# EAGLE schematic fin_solder (EAGLE 7.5.0)
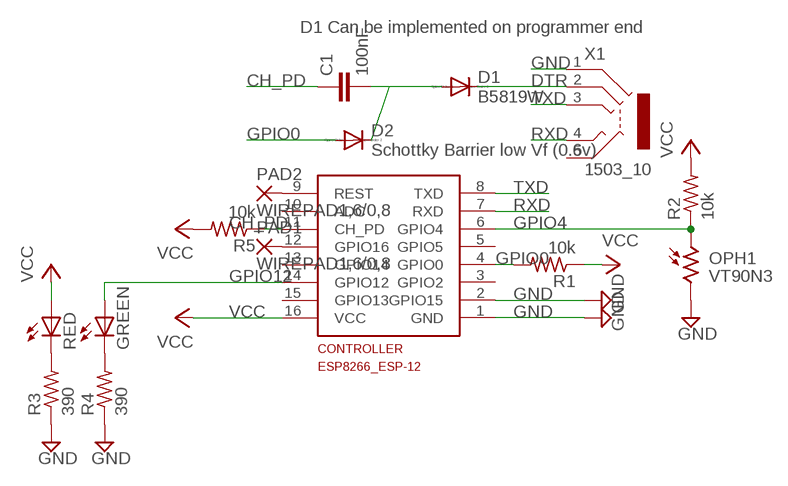
[diagram p0: schematic, sheet 1]

## Parts
C1  100nF  C-EUC0603  [C0603]
CONTROLLER  ESP8266_ESP-12  [ESP8266-ESP12]
D1  B5819W  DIODE-D-7.5  [D-7.5]
D2  Schottky Barrier low Vf (0.6v)  DIODE-D-7.5  [D-7.5]
GREEN  LED3MM  [LED3MM]
OPH1  VT90N3  [VT900]
PAD1  WIREPAD1,6/0,8  [1,6/0,8]
PAD2  WIREPAD1,6/0,8  [1,6/0,8]
R1  10k  R-US_0309/12  [0309/12]
R2  10k  R-US_0309/12  [0309/12]
R3  390  R-US_0309/12  [0309/12]
R4  390  R-US_0309/12  [0309/12]
R5  10k  R-US_0309/12  [0309/12]
RED  LED3MM  [LED3MM]
X1  1503_10  [1503_10]

## Nets
CH_PD: C1.1 CONTROLLER.11(CH_PD) R5.1
DTR: D1.C X1.2
GND: CONTROLLER.1(GND) CONTROLLER.2(GPIO15) OPH1.2 R3.1 R4.1 X1.1
GPIO0: CONTROLLER.4(GPIO0) D2.A R1.2
GPIO4: CONTROLLER.6(GPIO4) OPH1.1 R2.1
GPIO12: CONTROLLER.14(GPIO12) GREEN.A
N$1: C1.2 D1.A D2.C
N$2: R3.2 RED.K(C)
N$3: GREEN.K(C) R4.2
N$4: CONTROLLER.12(GPIO16) PAD1.1(P)
N$5: CONTROLLER.9(REST) PAD2.1(P)
RXD: CONTROLLER.7(RXD) X1.4
TXD: CONTROLLER.8(TXD) X1.3
VCC: CONTROLLER.16(VCC) R1.1 R2.2 R5.2 RED.A
Unconnected: CONTROLLER.3(GPIO2) CONTROLLER.5(GPIO5) CONTROLLER.10(ADC) CONTROLLER.13(GPIO14) CONTROLLER.15(GPIO13) X1.5

## Notes on the sheet
- D1 Can be implemented on programmer end

## Library data of the parts
C1 = rcl:C-EU: CAPACITOR, European symbol
CONTROLLER = ESP8266-ESP12:ESP8266_ESP-12
D1 D2 = diode:DIODE-: DIODE
GREEN RED = led:LED: LED OSRAM: - CHIPLED LG R971, LG N971, LY N971, LG Q971, LY Q971, LO R971, LY R971 LH N974, LH R974 LS Q976, LO Q976, LY Q976 LO Q996 - Hyper CHIPLED LW Q18S LB Q993, LB Q99A, LB R99A - SideLED LS A670, LO A670, LY A670, LG A670, LP A670 LB A673, LV A673, LT A673, LW A673 LH A674 LY A675 LS A676, LA A676, LO A676, LY A676, LW A676 LS A679, LY A679, LG A679 - Hyper Micro SIDELED® LS Y876, LA Y876, LO Y876, LY Y876 LT Y87S - SmartLED LW L88C, LW L88S LB L89C, LB L89S, LG L890 LS L89K, LO L89K, LY L89K LS L896, LA L896, LO L896, LY L896 - TOPLED LS T670, LO T670, LY T670, LG T670, LP T670 LSG T670, LSP T670, LSY T670, LOP T670, LYG T670 LG T671, LOG T671, LSG T671 LB T673, LV T673, LT T673, LW T673 LH T674 LS T676, LA T676, LO T676, LY T676, LB T676, LH T676, LSB T676, LW T676 LB T67C, LV T67C, LT T67C, LS T67K, LO T67K, LY T67K, LW E67C LS E67B, LA E67B, LO E67B, LY E67B, LB E67C, LV E67C, LT E67C LW T67C LS T679, LY T679, LG T679 LS T770, LO T770, LY T770, LG T770, LP T770 LB T773, LV T773, LT T773, LW T773 LH T774 LS E675, LA E675, LY E675, LS T675 LS T776, LA T776, LO T776, LY T776, LB T776 LHGB T686 LT T68C, LB T68C - Hyper Mini TOPLED® LB M676 - Mini TOPLED Santana® LG M470 LS M47K, LO M47K, LY M47K Source: http://www.osram.convergy.de LUXEON: - LUMILED® LXK2-PW12-R00, LXK2-PW12-S00, LXK2-PW14-U00, LXK2-PW14-V00 LXK2-PM12-R00, LXK2-PM12-S00, LXK2-PM14-U00 LXK2-PE12-Q00, LXK2-PE12-R00, LXK2-PE12-S00, LXK2-PE14-T00, LXK2-PE14-U00 LXK2-PB12-K00, LXK2-PB12-L00, LXK2-PB12-M00, LXK2-PB14-N00, LXK2-PB14-P00, LXK2-PB14-Q00 LXK2-PR12-L00, LXK2-PR12-M00, LXK2-PR14-Q00, LXK2-PR14-R00 LXK2-PD12-Q00, LXK2-PD12-R00, LXK2-PD12-S00 LXK2-PH12-R00, LXK2-PH12-S00 LXK2-PL12-P00, LXK2-PL12-Q00, LXK2-PL12-R00 Source: www.luxeon.com KINGBRIGHT: KA-3528ASYC Source: www.kingbright.com
OPH1 = photo-elements:VT9: Photoconductive Cell VT900 Series Source: http://optoelectronics.perkinelmer.com/content/Datasheets/DTS_vt900seriesdatasheet.pdf
PAD1 PAD2 = wirepad:WIREPAD: Wire PAD connect wire on PCB
R1-R5 = rcl:R-US_: RESISTOR, American symbol
X1 = con-lumberg:1503_10: Jack connectors according to JISC 6560, 3.5 mm Klinkeneinbaukupplung, 3,5 mm, 4-polig/stereo, abgewinkelte Ausführung Source: http://www.lumberg.de/Produkte/PDFs/1503_10.pdf; OC_FARNELL: 1308868; OC_NEWARK: unknown